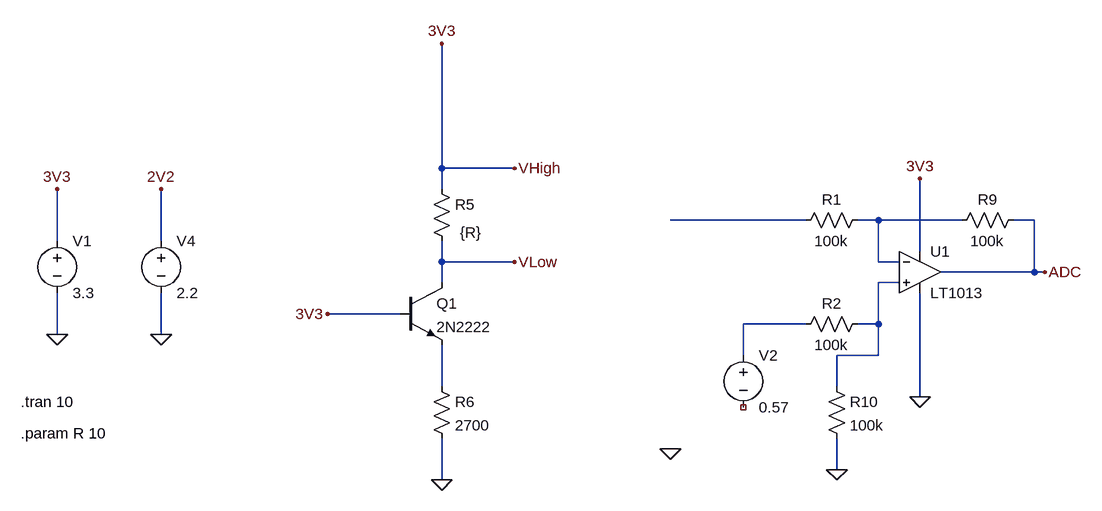
[diagram p0: schematic const_current.asc]
const_current.asc, the LTspice schematic file:
Version 4
SHEET 1 2176 748
WIRE 336 112 336 -80
WIRE 448 112 336 112
WIRE 336 144 336 112
WIRE 896 192 688 192
WIRE 1008 192 976 192
WIRE 1136 192 1008 192
WIRE 1248 192 1216 192
WIRE -256 224 -256 144
WIRE -96 224 -96 144
WIRE 1072 240 1072 128
WIRE 336 256 336 224
WIRE 448 256 336 256
WIRE 1008 256 1008 192
WIRE 1040 256 1008 256
WIRE 1248 272 1248 192
WIRE 1248 272 1104 272
WIRE 1264 272 1248 272
WIRE 336 288 336 256
WIRE 1040 288 1008 288
WIRE 272 336 160 336
WIRE 896 352 800 352
WIRE 1008 352 1008 288
WIRE 1008 352 976 352
WIRE -256 368 -256 304
WIRE -96 368 -96 304
WIRE 800 400 800 352
WIRE 1008 400 1008 352
WIRE 1008 400 944 400
WIRE 336 448 336 384
WIRE 944 448 944 400
WIRE 1072 464 1072 304
WIRE 944 576 944 528
WIRE 336 592 336 528
FLAG -256 368 0
FLAG -256 144 3V3
FLAG 1072 128 3V3
FLAG 1264 272 ADC
FLAG 944 576 0
FLAG 1072 464 0
FLAG 336 592 0
FLAG 448 112 VHigh
FLAG 448 256 VLow
FLAG 160 336 3V3
FLAG 688 544 0
FLAG -96 368 0
FLAG -96 144 2V2
FLAG 336 -80 3V3
SYMBOL voltage -256 208 R0
WINDOW 123 0 0 Left 0
WINDOW 39 0 0 Left 0
SYMATTR InstName V1
SYMATTR Value 3.3
SYMBOL res 992 176 R90
WINDOW 0 0 56 VBottom 2
WINDOW 3 32 56 VTop 2
SYMATTR InstName R1
SYMATTR Value 100k
SYMBOL res 992 336 R90
WINDOW 0 0 56 VBottom 2
WINDOW 3 32 56 VTop 2
SYMATTR InstName R2
SYMATTR Value 100k
SYMBOL res 1232 176 R90
WINDOW 0 0 56 VBottom 2
WINDOW 3 32 56 VTop 2
SYMATTR InstName R9
SYMATTR Value 100k
SYMBOL res 928 432 R0
SYMATTR InstName R10
SYMATTR Value 100k
SYMBOL OpAmps\\LT1013 1072 208 R0
SYMATTR InstName U1
SYMBOL res 320 128 R0
WINDOW 3 44 83 Left 2
SYMATTR Value {R}
SYMATTR InstName R5
SYMBOL npn 272 288 R0
SYMATTR InstName Q1
SYMATTR Value 2N2222
SYMBOL res 320 432 R0
SYMATTR InstName R6
SYMATTR Value 2700
SYMBOL voltage 800 384 R0
WINDOW 123 0 0 Left 0
WINDOW 39 0 0 Left 0
SYMATTR InstName V2
SYMATTR Value 0.57
SYMBOL voltage -96 208 R0
WINDOW 123 0 0 Left 0
WINDOW 39 0 0 Left 0
SYMATTR InstName V4
SYMATTR Value 2.2
TEXT -312 472 Left 2 !.tran 10
TEXT -312 520 Left 2 !.param R 10

The netlist it stands for:
* const_current.asc
V1 VHigh 0 3.3
R1 N002 N001 100k
R2 N003 N004 100k
R9 ADC N002 100k
R10 N003 0 100k
XU1 N003 N002 VHigh 0 ADC LT1013  ; pins In+ In- V+ V- OUT
R5 VHigh VLow {R}
Q1 VLow VHigh N005 0 2N2222
R6 N005 0 2700
V2 N004 NC_01 0.57
V4 2V2 0 2.2
.model NPN NPN
.model PNP PNP
.lib standard.bjt
.tran 10
.param R 10
.lib LTC.lib
.backanno
.end